# Altium project PCB_Project.PrjPcb
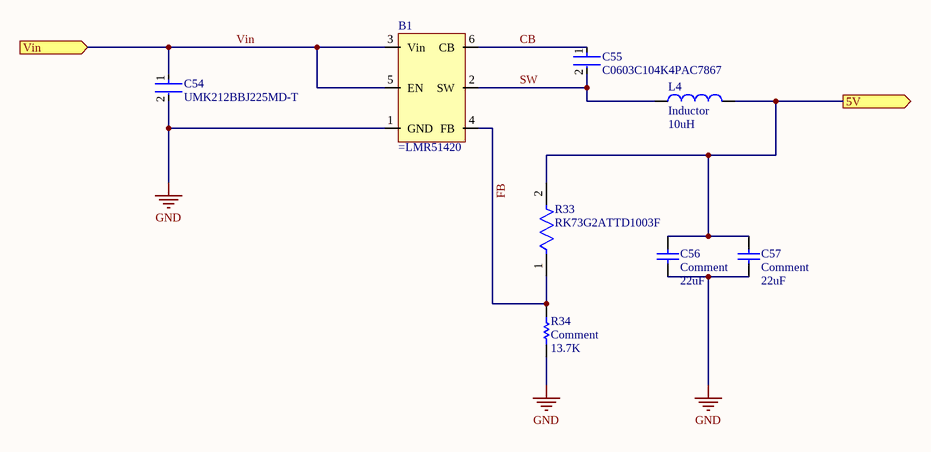
[diagram p0: LMR514205V.SchDoc]
3 sheets, 38 parts. Net scope: flat (ports and power ports of the same name join across sheets).
Board file: pcb403.PcbDoc
Sheets:
  LMR514205V.SchDoc
  LMR514203.3V.SchDoc
  TPS6513x.SchDoc

## Sheet LMR514205V.SchDoc
size A; SheetNumber: 10; SheetTotal: 16

### Parts
B1  (no value)  [PCBComponent_1]
C54  UMK212BBJ225MD-T  [FP-0805-L_2_0_0_2-W_1_25-IPC_A]
C55  C0603C104K4PAC7867  [FP-C0603C-CF-MFG]
C56  Comment  value 22uF  [Cap22uF_C1206C226M4PAC7800]
C57  Comment  value 22uF  [Cap22uF_C1206C226M4PAC7800]
L4  Inductor  value 10uH  [0402-A]
R33  RK73G2ATTD1003F  [FP-RK73G2A-IPC_A]
R34  Comment  value 13.7K  [RMCF0805FT13K7_13.7k]

### Ports
5V (out), Vin (in)

### Nets
GND: B1.1(GND) C54.2 C56.1 C57.1 R34.1
CB: B1.6(CB) C55.1
FB: B1.4(FB) R33.1 R34.2
SW: B1.2(SW) C55.2 L4.1
Vin: B1.3(Vin) B1.5(EN) C54.1 ; port Vin
NetC56_2: C56.2 C57.2 L4.2 R33.2 ; port 5V

### Library data of the parts
B1 = Component_1
C54 = CMP-14477-004278-2: Multilayer Ceramic Capacitor 2.2uF 50V X5R 20% SMD 0803 T/R; Max Operating Temperature: 85°C; Tolerance: 20%; Case Code (Imperial): 0805; Case/Package: 0805; Case Code (Metric): 2012; Capacitance: 2.2uF; Min Operating Temperature: -55°C; Mount: Surface Mount; Voltage Rating: 50V; Packaging: Tape and Reel; RoHS Compliant: Yes
C55 = CMP-03020-002384-2: CAP CER 0.1UF 16V X5R 0603; Manufacturer: KEMET; Automotive Grade: Grade 1; Value: 0.10 μF; Material: Ceramic; Temperature Coefficient: 30ppm/°C; Tolerance: 0.1; Manufacturer Part Number: C0603C104K4PAC7867; Automotive: Yes; Octopart: https://octopart.com/c0603c104k4pactu-kemet-12592163; Device Class L2: Capacitors; ComponentLink2URL: https://api.kemet.com/component-edge/download/datasheet/C0603C100J5GACAUTO.pdf; RoHS: TRUE; Height: 0.87mm; Temperature Characteristic: X5R; Voltage Rating: 16 V; Device Class L1: Passive Components; Category: Cap; Digikey Description: CAP CER 0.1UF 16V X5R 0603; Temperature Range High: +125°C; Package: C0603C-CF; Device Class L3: Ceramic Capacitors; Lead Free: Yes; Temperature: -55°C to +125°C; Temperature Range Low: -55°C; Capacitance: 0.10 μF; ComponentLink2Description: Datasheet
C56 C57 = Cap: Capacitor; Published: 8-Jun-2000; LatestRevisionDate: 17-Jul-2002; LatestRevisionNote: Re-released for DXP Platform.; PackageReference: RAD-0.3; Publisher: Altium Limited; PackageDescription: Radial Cap, Thru-Hole; 2 Leads; 0.3 in Pin Spacing
L4 = Inductor: Code_IEC: 1005; Published: 8-Jun-2000; LatestRevisionDate: 29-May-2009; LatestRevisionNote: IPC-7351 Footprint Added.; PackageReference: 0402-A; Publisher: Altium Limited; PackageDescription: Chip Inductor; Code_JEITA: 0402
R33 = CMP-04015-080178-1: 100kΩ ±1% 0.125W Chip Resistor 0805 Thick Film AEC-Q200 Qualified; Voltage Rating: 150V; Power Rating: 125mW; Temperature Coefficient: 50ppm/°C; Resistance: 100kR; Series: RK73G; Termination: SMD/SMT; Packaging: Tape and Reel; Tolerance: 1%; Case Code (Imperial): 0805; RoHS Compliant: Yes; Max Operating Temperature: 125°C; Min Operating Temperature: -55°C; Case Code (Metric): 2012
R34 = Res1: Resistor; Published: 8-Jun-2000; LatestRevisionDate: 17-Jul-2002; LatestRevisionNote: Re-released for DXP Platform.; PackageReference: AXIAL-0.3; Publisher: Altium Limited; PackageDescription: Axial Device, Thru-Hole; 2 Leads; 0.3 in Pin Spacing

## Sheet LMR514203.3V.SchDoc
size A; SheetNumber: 9; SheetTotal: 16
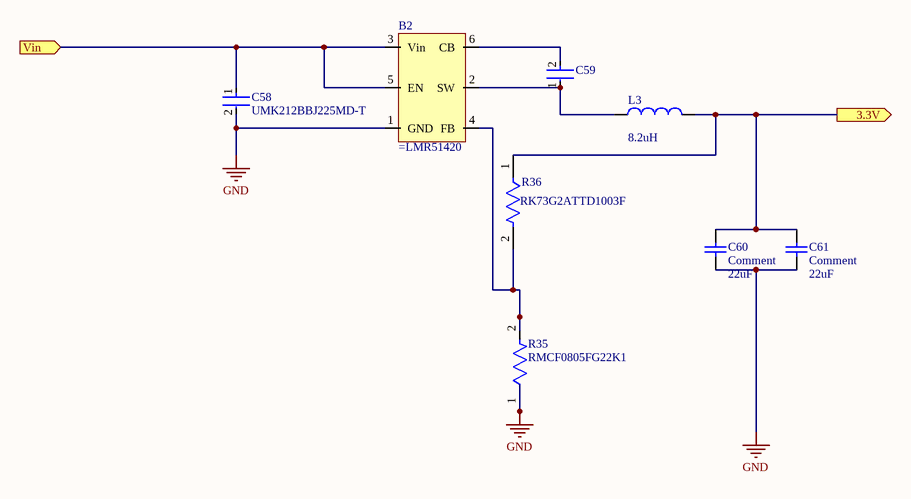
[diagram p1: LMR514203.3V.SchDoc]

### Parts
B2  (no value)  [PCBComponent_1]
C58  UMK212BBJ225MD-T  [FP-0805-L_2_0_0_2-W_1_25-IPC_A]
C59  C0603C104K4PAC7867  [FP-C0603C-CF-MFG]  (value not drawn)
C60  Comment  value 22uF  [Cap22uF_C1206C226M4PAC7800]
C61  Comment  value 22uF  [Cap22uF_C1206C226M4PAC7800]
L3  value 8.2uH  [0402-A]  (hidden comment: MSS1260H-822MED)
R35  RMCF0805FG22K1  [FP-RMCF0805-IPC_B]
R36  RK73G2ATTD1003F  [FP-RK73G2A-IPC_A]

### Ports
3.3V (out), Vin (in)

### Nets
GND: B2.1(GND) C58.2 C60.1 C61.1 R35.1
Vin: B2.3(Vin) B2.5(EN) C58.1 ; port Vin
NetB2_2: B2.2(SW) C59.1 L3.1
NetB2_4: B2.4(FB) R35.2 R36.2
NetB2_6: B2.6(CB) C59.2
NetC42_1: C60.2 C61.2 L3.2 R36.1 ; port 3.3V

### Library data of the parts
B2 = Component_1
C58 = CMP-14477-004278-2: as C54 on sheet LMR514205V; Max Operating Temperature: 85°C; Tolerance: 20%; Case Code (Imperial): 0805; Case/Package: 0805; Case Code (Metric): 2012; Capacitance: 2.2uF; Min Operating Temperature: -55°C; Mount: Surface Mount; Voltage Rating: 50V; Packaging: Tape and Reel; RoHS Compliant: Yes
C59 = CMP-03020-002384-2: as C55 on sheet LMR514205V; Manufacturer Part Number: C0603C104K4PAC7867; Automotive: Yes; Octopart: https://octopart.com/c0603c104k4pactu-kemet-12592163; Device Class L2: Capacitors; ComponentLink2URL: https://api.kemet.com/component-edge/download/datasheet/C0603C100J5GACAUTO.pdf; RoHS: TRUE; Height: 0.87mm; Temperature Characteristic: X5R; Voltage Rating: 16 V; Device Class L1: Passive Components; Category: Cap; Digikey Description: CAP CER 0.1UF 16V X5R 0603; Temperature Range High: +125°C; Package: C0603C-CF; Device Class L3: Ceramic Capacitors; Lead Free: Yes; Temperature: -55°C to +125°C; Temperature Range Low: -55°C; Capacitance: 0.10 μF; ComponentLink2Description: Datasheet
C60 C61 = Cap: Capacitor; Published: 8-Jun-2000; LatestRevisionDate: 17-Jul-2002; LatestRevisionNote: Re-released for DXP Platform.; PackageReference: RAD-0.3; Publisher: Altium Limited; PackageDescription: Radial Cap, Thru-Hole; 2 Leads; 0.3 in Pin Spacing
L3 = Inductor: Code_IEC: 1005; Published: 8-Jun-2000; LatestRevisionDate: 29-May-2009; LatestRevisionNote: IPC-7351 Footprint Added.; PackageReference: 0402-A; Publisher: Altium Limited; PackageDescription: Chip Inductor; Code_JEITA: 0402
R35 = CMP-26527-006791-1: 22.1kΩ ±1% 0.125W 0805 Thick Film Chip Resistor AEC-Q200 compliant; Max Power Dissipation: 125mW; Temperature Coefficient: 100ppm/°C; Resistance: 22.1kR; Max Operating Temperature: 155°C; Length: 0.079inch; Series: RMCF; RoHS Compliant: Yes; Number of Terminations: 2; Contact Plating: Tin; Width: 0.049inch; Package Quantity: 10000; Radiation Hardening: No; Height: 0.026inch; Features: Automotive AEC-Q200; Lead Free: Lead Free; Case Code (Imperial): 0805; Packaging: Tape and Reel; Mount: Surface Mount; Case/Package: 0805; Resistor Type: Thick Film; Case Code (Metric): 2012; Min Operating Temperature: -55°C; Tolerance: 1%
R36 = CMP-04015-080178-1: as R33 on sheet LMR514205V; Series: RK73G; Termination: SMD/SMT; Packaging: Tape and Reel; Tolerance: 1%; Case Code (Imperial): 0805; RoHS Compliant: Yes; Max Operating Temperature: 125°C; Min Operating Temperature: -55°C; Case Code (Metric): 2012

## Sheet TPS6513x.SchDoc
size A; SheetNumber: 11; SheetTotal: 16
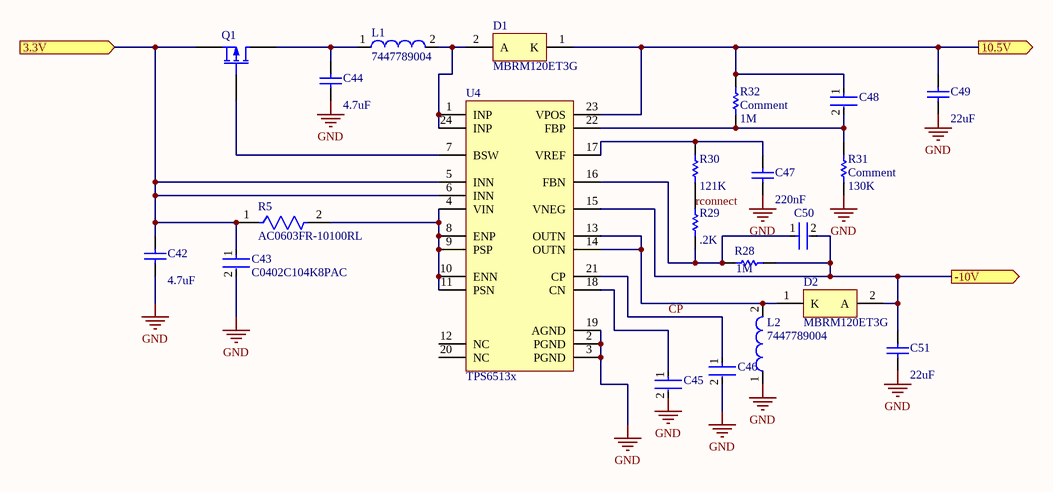
[diagram p2: TPS6513x.SchDoc]

### Parts
C42  value 4.7uF  [4.7uF_C1206C475K3RACAUTO]  (hidden comment: Comment)
C43  C0402C104K8PAC  [FP-C0402-BB-MFG]
C44  value 4.7uF  [4.7uF_C1206C475K3RACAUTO]  (hidden comment: Comment)
C45  C1206C472J5GAC  [FP-C1206C-EB-MFG]  (value not drawn)
C46  C0402C103J4RAC  [FP-C0402-BB-MFG]  (value not drawn)
C47  value 220nF  [PCBComponent_1]  (hidden comment: Comment)
C48  CGA1A2C0G1E6R8D030BA  [FP-CGA1A-0_1-0_03-IPC_B]  (value not drawn)
C49  value 22uF  [Cap22uF_C1206C226M4PAC7800]  (hidden comment: Comment)
C50  C0805C759D5GACTU  [FP-C0805C-DN-MFG]  (value not drawn)
C51  value 22uF  [Cap22uF_C1206C226M4PAC7800]  (hidden comment: Comment)
D1  MBRM120ET3G  [ONSC-POWERMITE-2-457-04_D_V]
D2  MBRM120ET3G  [ONSC-POWERMITE-2-457-04_D_V]
L1  7447789004  [WE-PD-S-PB]
L2  7447789004  [WE-PD-S-PB]
Q1  Comment  [PCBComponent_1]  (value not drawn)
R5  AC0603FR-10100RL  [FP-AC0603-IPC_A]
R28  value 1M  [1Mohm_ESR01MZPF1004]  (hidden comment: Comment)
R29  value .2K  [200ohm_ESR01MZPF2000]  (hidden comment: Comment)
R30  value 121K  [121k_RE0201BRE07121KL]  (hidden comment: Comment)
R31  Comment  value 130K  [130k_RGV3216P-1303-B-T1]
R32  Comment  value 1M  [1Mohm_ESR01MZPF1004]
U4  TPS6513x  [RGE0024B_V]

### Ports
3.3V (in), 10.5V (out), -10V (out)

### Nets
GND: C42.2 C43.2 C44.2 C45.2 C46.2 C47.1 C49.1 C51.1 L2.1 R31.1 U4.2(PGND) U4.3(PGND) U4.19(AGND)
CP: C46.1 U4.21(CP)
NetC42_1: C42.1 C43.1 Q1.3(S) R5.1 U4.5(INN) U4.6(INN) ; port 3.3V
NetC44_1: C44.1 L1.1 Q1.1(D)
NetC45_1: C45.1 U4.18(CN)
NetC47_2: C47.2 R30.2 U4.17(VREF)
NetC48_1: C48.1 C49.2 D1.1(K) R32.2 U4.23(VPOS) ; port 10.5V
NetC48_2: C48.2 R31.2 R32.1 U4.22(FBP)
NetC50_1: C50.1 R28.2 R29.1 U4.16(FBN)
NetC50_2: C50.2 C51.2 D2.2(A) R28.1 U4.15(VNEG) ; port -10V
NetD1_2: D1.2(A) L1.2 U4.1(INP) U4.24(INP)
NetD2_1: D2.1(K) L2.2 U4.13(OUTN) U4.14(OUTN)
NetQ1_2: Q1.2(G) U4.7(BSW)
NetR5_2: R5.2 U4.4(VIN) U4.8(ENP) U4.9(PSP) U4.10(ENN) U4.11(PSN)
NetR29_2: R29.2 R30.1

Not connected (* = marked no-connect by the designer): U4 12(NC) 20(NC)

### Notes on the sheet
- Labels drawn without touching a wire or pin: rconnect

### Library data of the parts
C42 C44 C47 C49 C51 = Cap: Capacitor; Published: 8-Jun-2000; LatestRevisionDate: 17-Jul-2002; LatestRevisionNote: Re-released for DXP Platform.; PackageReference: RAD-0.3; Publisher: Altium Limited; PackageDescription: Radial Cap, Thru-Hole; 2 Leads; 0.3 in Pin Spacing
C43 = CMP-03020-000918-1: C0402 0.10 μF X5R 10.00% 10 V; Manufacturer: Kemet; Value: 0.10 μF; Voltage Rating: 10 V; Temperature Coefficient: 15%; Material: Ceramic; Tolerance: 0.1; Device Class L1: Passive Components; ComponentLink2URL: https://content.kemet.com/datasheets/KEM_C1002_X7R_SMD.pdf; Manufacturer Part Number: C0402C104K8PAC; RoHS: TRUE; Capacitance: 0.10 μF; Category: Cap; Lead Free: Yes; Octopart: https://octopart.com/c0402c104k8pac-kemet-2645080; Mouser Description: Cap-fxd 0.1UF +-10PCT 10V Cer X5R 0402 S; Device Class L2: Capacitors; Ipc Land Pattern Name: CAPC10050X50; Temperature Characteristic: X5R; Device Class L3: Ceramic Capacitors; Temperature Range High: +125°C; Package: C0402-BB; Temperature Range Low: -55°C; Automotive: No; Height: 0.55mm; ComponentLink2Description: Datasheet; Temperature: -55°C to +125°C
C45 = CMP-03020-017963-1: C1206 4,700 pF C0G 5.00% 50 V; Manufacturer: KEMET; Material: Ceramic; Automotive Grade: Grade 0; Voltage Rating: 50 V; Temperature Coefficient: 15%; Tolerance: 0.05; Ipc Land Pattern Name: CAPC320160X78; Temperature Range Low: -55°C; Temperature: -55°C to +150°C; Octopart: https://octopart.com/c1206c472j5gac-kemet-1350327; ComponentLink2Description: Datasheet; Height: 0.88mm; Device Class L2: Capacitors; Package: C1206C-EB; Capacitance: 4,700 pF; Device Class L3: Ceramic Capacitors; Automotive: Yes; Temperature Range High: +150°C; Temperature Characteristic: C0G; Category: Cap; Manufacturer Part Number: C1206C472J5GAC; Lead Free: Yes; Mouser Description: Multilayer Ceramic Capacitors MLCC - SMD/SMT 50volts 4700pF 5% C0G; Value: 4,700 pF; RoHS: TRUE; Device Class L1: Passive Components; ComponentLink2URL: https://content.kemet.com/datasheets/KEM_C1007_X8R_ULTRA_150C_SMD.pdf
C46 = CMP-03020-009089-1: C0402 10,000 pF X7R 5.00% 16 V; Manufacturer: Kemet; Tolerance: 0.05; Material: Ceramic; Voltage Rating: 16 V; Temperature Coefficient: 15%; Value: 10,000 pF; Category: Cap; Manufacturer Part Number: C0402C103J4RAC; ComponentLink2URL: https://content.kemet.com/datasheets/KEM_C1002_X7R_SMD.pdf; Octopart: https://octopart.com/c0402c103j4rac-kemet-8293494; Temperature Range High: +125°C; Temperature: -55°C to +125°C; RoHS: TRUE; Device Class L1: Passive Components; Lead Free: Yes; Temperature Range Low: -55°C; Ipc Land Pattern Name: CAPC10050X50; Package: C0402-BB; Mouser Description: Multilayer Ceramic Capacitors MLCC - SMD/SMT 16volts 0.01uF 5% X7R; Temperature Characteristic: X7R; Device Class L3: Ceramic Capacitors; Height: 0.55mm; Device Class L2: Capacitors; ComponentLink2Description: Datasheet; Capacitance: 10,000 pF; Automotive: No
C48 = CMP-08246-001552-1: Cap Ceramic 6.8pF 25V C0G 0.5pF Pad SMD 0201 125°C Automotive T/R; Min Operating Temperature: -55°C; Packaging: Tape and Reel; Mount: Surface Mount; Length: 0.6mm; Dielectric: C0G; Depth: 0.3mm; Ratings: AEC-Q200; Case Code (Metric): 0603; Height: 0.3mm; Weight: 6E-06oz; Case Code (Imperial): 0201; Case/Package: 0201; Thickness: 0.013inch; Voltage Rating: 25V; Package Quantity: 1; Voltage Rating (DC): 25V; Composition: Ceramic; Max Operating Temperature: 125°C; Width: 0.012inch; Capacitance: 6.8pF; Termination: SMD/SMT
C50 = CMP-1036-00734-2: CAP CER 7.5PF 50V NP0 0805; Manufacturer: KEMET; Temperature Characteristic: C0G; Tolerance: 0.5 pF; Material: Ceramic; Temperature Coefficient: 30ppm/°C; Package: C0805C-DN; Value: 7.5 pF; Ipc Land Pattern Name: CAPC200125X78; Category: Cap; Height: 0.88mm; ComponentLink2URL: https://content.kemet.com/datasheets/KEM_C1003_C0G_SMD.pdf; Temperature: -55°C to +125°C; Device Class L3: Ceramic Capacitors; Mouser Description: Multilayer Ceramic Capacitors MLCC - SMD/SMT 50volts 7.5pF C0G 0.5%; Capacitance: 7.5 pF; Manufacturer Part Number: C0805C759D5GACTU; Lead Free: Yes; Octopart: https://octopart.com/c0805c759d5gactu-kemet-17134963; Temperature Range Low: -55°C; ComponentLink2Description: Datasheet; Voltage Rating: 50 V; Temperature Range High: +125°C; Device Class L2: Capacitors; RoHS: TRUE; Device Class L1: Passive Components; Automotive: No; Digikey Description: CAP CER 7.5PF 50V NP0 0805
D1 D2 = CMP-1055-00280-1: Schottky Power Rectifier, 2-Pin Powermite, Pb-Free, Tape and Reel; Manufacturer: On Semiconductor; Configuration: Single; IFSM Max (A): 50; Packing: Tape and Reel; ComponentLink1URL: http://www.onsemi.com/; PartNumber: MBRM120ET3G; Mounting Technology: Surface Mount; PackageReference: POWERMITE-2-457-04; DatasheetVersion: Rev. 3; ComponentLink2URL: http://www.onsemi.cn/pub_link/Collateral/MBRM120E-D.PDF; ComponentLink2Description: Datasheet; PackageVersion: Rev. F, 05/2013; ComponentLink3URL: http://www.onsemi.com/pub_link/Collateral/457-04.PDF; RoHS: TRUE; PackageDescription: 2-Pin POWERMITE, Body 1.965 x 1.9 mm; ComponentLink3Description: Package Specification; ComponentLink1Description: Manufacturer URL
L1 L2 = CMP-1396-00050-1: SMD-Shielded Power Inductor WE-PD, L=4.70 µH; Manufacturer: Wuerth Elektronik; Inductance: 4.70 ÂµH; ComponentLink2URL: http://www.we-online.de/katalog/media/pdf/7447789004.pdf; ComponentLink2Description: Datasheet; PackageDescription: SMD Inductor, 2-Leads, Body 7.3 x 7.3 mm; ComponentLink1Description: Manufacturer URL; PackageReference: WE-PD-S-PB; ComponentLink1URL: http://www.we-online.com; PartNumber: 7447789004
Q1 = MOSFET-P: P-Channel MOSFET; Published: 8-Jun-2000; LatestRevisionDate: 17-Jul-2002; LatestRevisionNote: Re-released for DXP Platform.; PackageVersion: 1995/1996; PackageReference: E3; Publisher: Altium Limited; PackageDescription: TO, Flat Index; 3 In-Line, Axial Leads; Body Dia. 4.6mm; Lead Dia. 0.5 mm (max)
R5 = CMP-03412-011629-2: RES 100Ω 1.00% 0.1W 0603; Tolerance: 1%; Resistance: 100R; RoHS Compliant: Yes; Case/Package: 0603
R28-R32 = Res1: Resistor; Published: 8-Jun-2000; LatestRevisionDate: 17-Jul-2002; LatestRevisionNote: Re-released for DXP Platform.; PackageReference: AXIAL-0.3; Publisher: Altium Limited; PackageDescription: Axial Device, Thru-Hole; 2 Leads; 0.3 in Pin Spacing
U4 = CMP-0347-00005-4: Boost Inverting Buck-Boost Voltage Converter with 2.7 to 5.5 V Input and -15 to 15 V Output, -40 to 85 degC, 24-Pin VQFN (RGE), Green (RoHS & no Sb/Br); PartNumber: TPS65130RGER; Manufacturer: Texas Instruments; Vout2(V): -15 to -2; Regulated Outputs(#): 2; Switching Frequency(Typ)(kHz): 1400; Vout(Max)(V): 15; Vin(Min)(V): 2.7; SubFamily: Step-Up Regulator; Vin(Max)(V): 5.5; Topology: Boost, Inverting Buck-Boost; ComponentLink2URL: http://www.ti.com/litv/pdf/mpqf124f; ComponentLink2Description: Package Specification; DatasheetVersion: SLVS493B; ComponentLink1Description: Datasheet; Code_JEDEC: MO-220; PackageVersion: revG, Jul-2011; ComponentLink1URL: http://www.ti.com/general/docs/lit/getliterature.tsp?genericPartNumber=TPS65130&fileType=pdf; Eco-Plan: Green (RoHS & no Sb/Br); PackageDescription: 24-Pin Plastic Quad Flatpack No-Lead, 4 x 4 mm Body, 0.5 mm Pitch; PackageReference: RGE0024B; Vout(Min)(V): -15; Mounting Technology: Surface Mount

## Nets that join several sheets
GND: LMR514205V (5 pins), LMR514203.3V (5 pins), TPS6513x (13 pins)
NetC42_1: LMR514203.3V (C60.2 C61.2 L3.2 R36.1), TPS6513x (6 pins)
Vin: LMR514205V (B1.3 B1.5 C54.1), LMR514203.3V (B2.3 B2.5 C58.1)